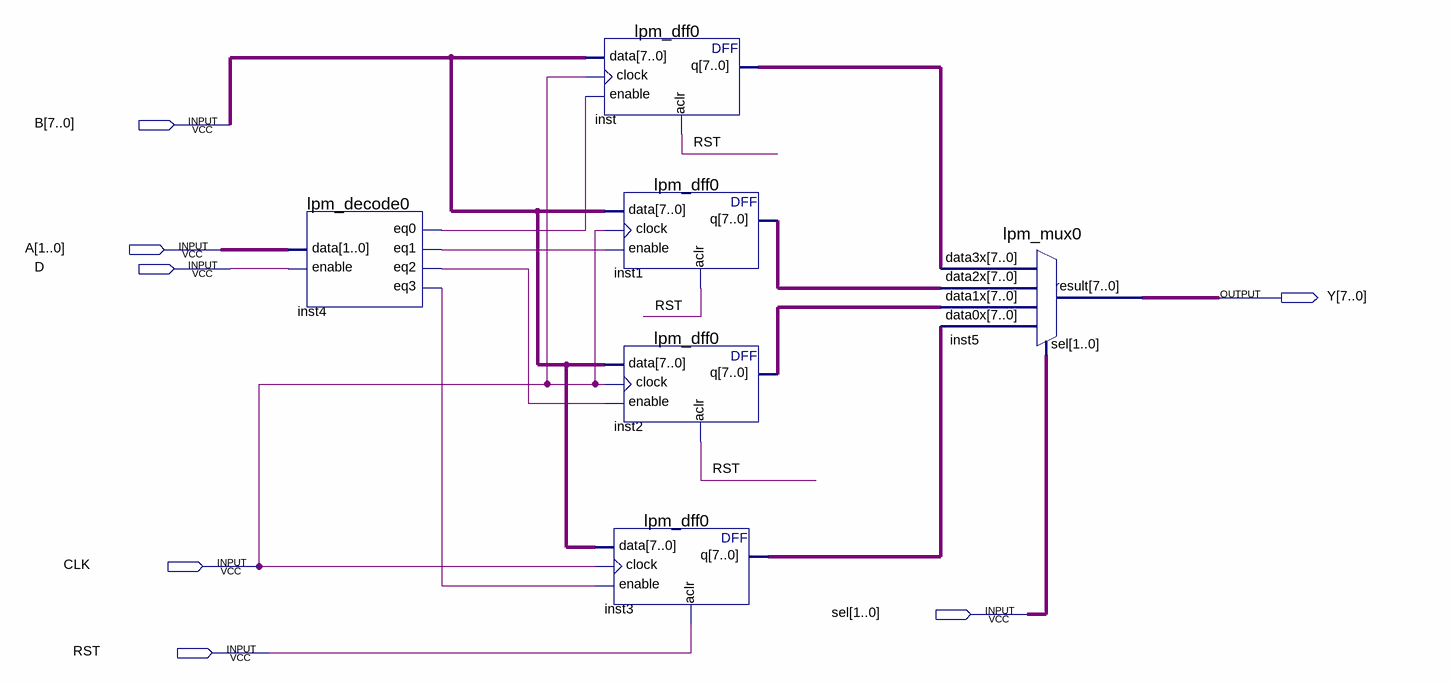
[diagram p0: schematic sheet]
// Quartus schematic newtest2021.bdf as structural Verilog: 6 symbols, 7 pins
module newtest2021 (
  input  [7:0] B,
  input  [1:0] A,
  input  D,
  input  CLK,
  input  [1:0] sel,
  input  RST,
  output [7:0] Y
);

  wire inst4_eq0, inst4_eq1, inst4_eq2, inst4_eq3;
  wire [7:0] inst1_q, inst2_q, inst3_q, inst_q;

  lpm_decode0 inst4 (.data(A), .enable(D), .eq0(inst4_eq0), .eq1(inst4_eq1), .eq2(inst4_eq2), .eq3(inst4_eq3));
  lpm_dff0 inst (.data(B), .clock(CLK), .enable(inst4_eq0), .aclr(RST), .q(inst_q));
  lpm_dff0 inst1 (.data(B), .clock(CLK), .enable(inst4_eq1), .aclr(RST), .q(inst1_q));
  lpm_dff0 inst2 (.data(B), .clock(CLK), .enable(inst4_eq2), .aclr(RST), .q(inst2_q));
  lpm_dff0 inst3 (.data(B), .clock(CLK), .enable(inst4_eq3), .aclr(RST), .q(inst3_q));
  lpm_mux0 inst5 (.data3x(inst_q), .data2x(inst1_q), .data1x(inst2_q), .data0x(inst3_q), .sel(sel), .result(Y));
endmodule
